# Altium schematic sheet VIDEO_DAC_THS8134B.SchDoc: Video DAC
size A4; Organization: Altium Limited.; Address1: Level 3, 12a Rodborough Rd; Address2: Frenchs Forest 2086; Address3: NSW; Address4: AUSTRALIA; SheetNumber: 1; SheetTotal: 100
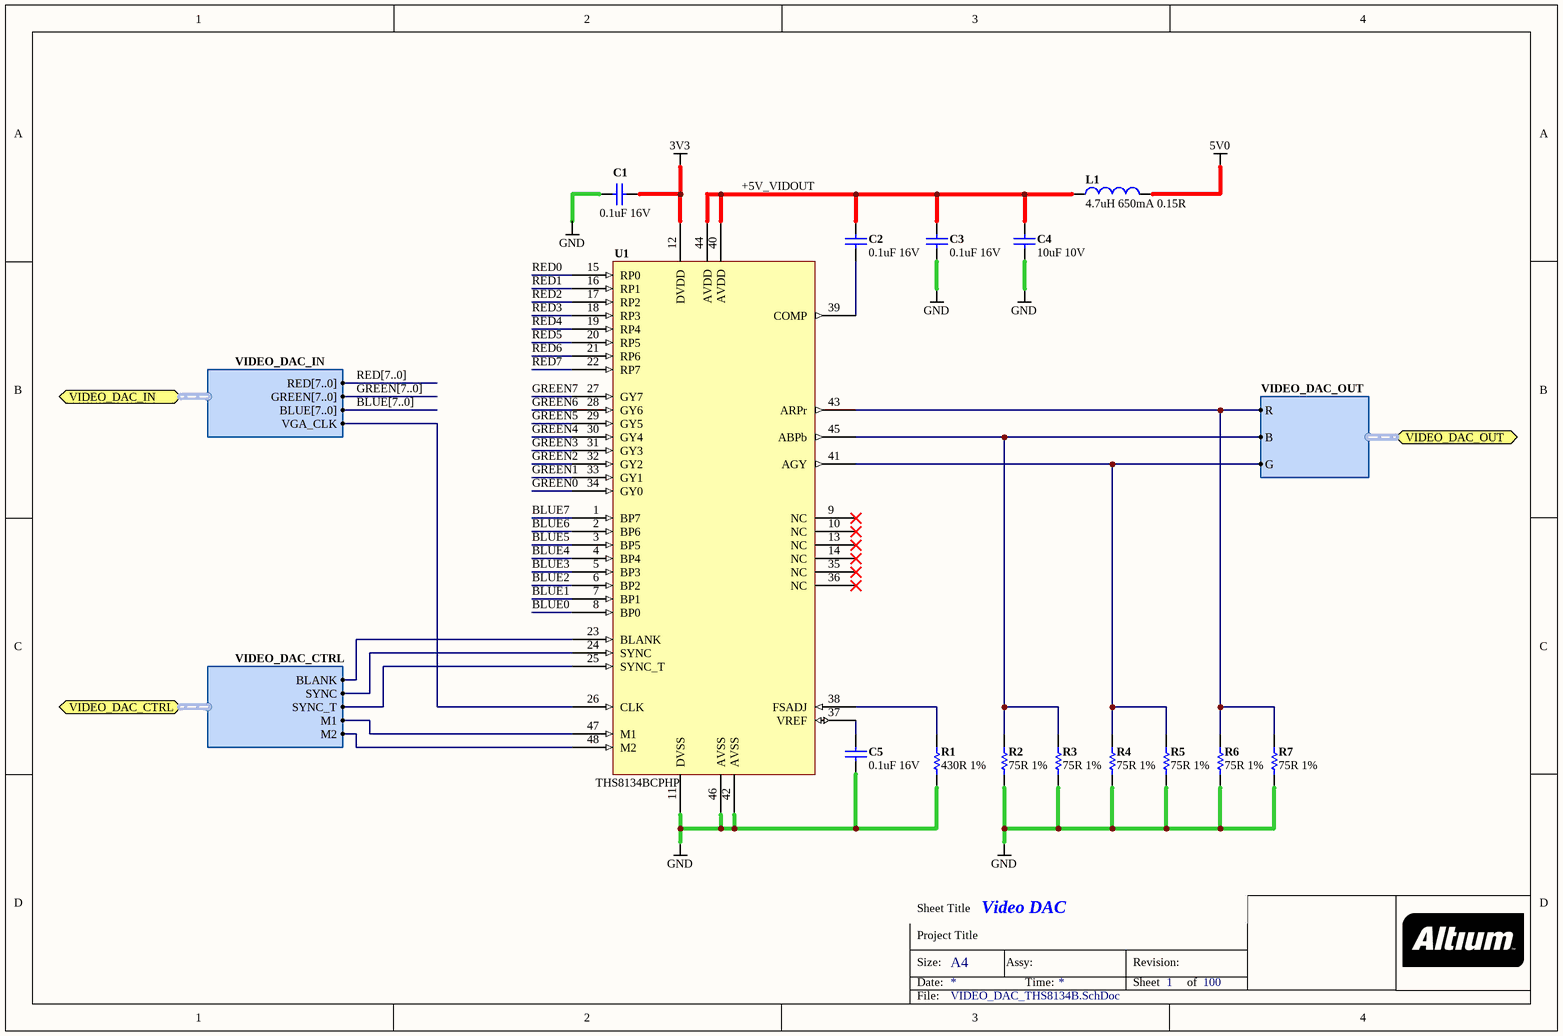
[diagram p0: VIDEO_DAC_THS8134B.SchDoc]

## Parts
C1  0.1uF 16V  [CAPC1005-STAR]
C2  0.1uF 16V  [CAPC1005-STAR]
C3  0.1uF 16V  [CAPC1005-STAR]
C4  10uF 10V  [CAPC2012-STAR]
C5  0.1uF 16V  [CAPC1005-STAR]
L1  4.7uH 650mA 0.15R  [INDC3225]
R1  430R 1%  [RESC1005-STAR]
R2  75R 1%  [RESC1005-STAR]
R3  75R 1%  [RESC1005-STAR]
R4  75R 1%  [RESC1005-STAR]
R5  75R 1%  [RESC1005-STAR]
R6  75R 1%  [RESC1005-STAR]
R7  75R 1%  [RESC1005-STAR]
U1  THS8134BCPHP  [TSQFP50P900X900_HS-48]

## Ports
VIDEO_DAC_CTRL (harness VIDEO_DAC_CTRL), VIDEO_DAC_IN (harness VIDEO_DAC_IN), VIDEO_DAC_OUT (harness VIDEO_DAC_OUT)

## Harnesses
VIDEO_DAC_OUT: B, R, G
VIDEO_DAC_IN: RED[7..0], GREEN[7..0], BLUE[7..0], VGA_CLK
VIDEO_DAC_CTRL: BLANK, SYNC, SYNC_T, M1, M2

## Nets
3V3: C1.1 U1.12(DVDD)
5V0: L1.1
GND: C1.2 C3.2 C4.1 C5.2 R1.1 R2.2 R3.1 R4.2 R5.1 R6.1 R7.1 U1.11(DVSS) U1.42(AVSS) U1.46(AVSS)
+5V_VIDOUT: C2.1 C3.1 C4.2 L1.2 U1.40(AVDD) U1.44(AVDD)
BLUE0: U1.8(BP0)
BLUE1: U1.7(BP1)
BLUE2: U1.6(BP2)
BLUE3: U1.5(BP3)
BLUE4: U1.4(BP4)
BLUE5: U1.3(BP5)
BLUE6: U1.2(BP6)
BLUE7: U1.1(BP7)
GREEN0: U1.34(GY0)
GREEN1: U1.33(GY1)
GREEN2: U1.32(GY2)
GREEN3: U1.31(GY3)
GREEN4: U1.30(GY4)
GREEN5: U1.29(GY5)
GREEN6: U1.28(GY6)
GREEN7: U1.27(GY7)
RED0: U1.15(RP0)
RED1: U1.16(RP1)
RED2: U1.17(RP2)
RED3: U1.18(RP3)
RED4: U1.19(RP4)
RED5: U1.20(RP5)
RED6: U1.21(RP6)
RED7: U1.22(RP7)
NetC2_2: C2.2 U1.39(COMP)
NetC5_1: C5.1 U1.37(VREF)
NetR1_2: R1.2 U1.38(FSADJ)
NetR2_1: R2.1 R3.2 U1.45(ABPb) ; port VIDEO_DAC_OUT.B
NetR4_1: R4.1 R5.2 U1.41(AGY) ; port VIDEO_DAC_OUT.G
NetR6_2: R6.2 R7.2 U1.43(ARPr) ; port VIDEO_DAC_OUT.R
NetU1_23: U1.23(BLANK) ; port VIDEO_DAC_CTRL.BLANK
NetU1_24: U1.24(SYNC) ; port VIDEO_DAC_CTRL.SYNC
NetU1_25: U1.25(SYNC_T) ; port VIDEO_DAC_CTRL.SYNC_T
NetU1_26: U1.26(CLK) ; port VIDEO_DAC_IN.VGA_CLK
NetU1_47: U1.47(M1) ; port VIDEO_DAC_CTRL.M1
NetU1_48: U1.48(M2) ; port VIDEO_DAC_CTRL.M2

Not connected (* = marked no-connect by the designer): U1 9(NC)* 10(NC)* 13(NC)* 14(NC)* 35(NC)* 36(NC)*

## Buses and harness runs
bus BLUE[7..0]
bus GREEN[7..0]
bus RED[7..0]

## Notes on the sheet
- Sheet Title
- Project Title
- Size:
- Date:
- A4
- Assy:
- Time:
- Revision:
- Sheet
- of
- File:

## Library data of the parts
C1-C3 C5 = D-101-0080: Capacitor, Ceramic, 0.1uF 10% 16V 0402 (1005) X7R; Polarity: Non-Polarized; Capacitance: 0.1 uF; Category: Capacitor; Dielectric: X7R; Mounting Technology: Surface Mount; Rated Voltage: 16 V; Status: Production; Technology: Ceramic; Tolerance: 10 %
C4 = D-101-0087: Capacitor, Ceramic, 10uF 10% 10V 0805 (2012) X5R; Polarity: Non-Polarized; Capacitance: 10 uF; Category: Capacitor; Dielectric: X5R; Mounting Technology: Surface Mount; Rated Voltage: 10 V; Status: Unreleased; Technology: None; Tolerance: 10 %
L1 = D-102-0005: Inductor, 4.7uH 650mA 0.15R 1210 (3225) LQH32CN4R7M11L; Category: Inductor; Status: Production
R1 = D-100-0096: Resistor, 430R 1% 0402 (1005); Power Rating: 63 mW; Category: Resistor; Mounting Technology: Surface Mount; Resistance: 430 R; Status: Production; Tolerance: 1 %
R2-R7 = D-100-0001: Resistor, 75R 1% 0402; Power Rating: mW; Resistance: mR; Category: Resistor; Mounting Technology: Surface Mount; Status: Production; Tolerance: 1 %
U1 = D-222-0000: THS8134BCPHP, Triple 8-Bit, 80 MSPS Video DAC with Tri-Level Sync Generation; Status: Production; Category: IC-DAC